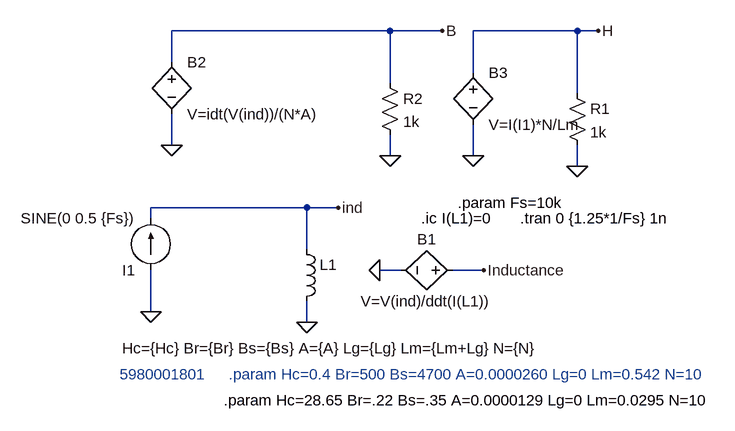
[diagram p0: schematic InductorBench2.asc]
InductorBench2.asc, the LTspice schematic file:
Version 4
SHEET 1 1124 852
WIRE 240 -192 -96 -192
WIRE 320 -192 240 -192
WIRE 528 -192 368 -192
WIRE 560 -192 528 -192
WIRE -96 -144 -96 -192
WIRE 368 -128 368 -192
WIRE 240 -112 240 -192
WIRE 528 -96 528 -192
WIRE -96 -16 -96 -64
WIRE 240 0 240 -32
WIRE 368 0 368 -48
WIRE 528 16 528 -16
WIRE 112 80 -128 80
WIRE 160 80 112 80
WIRE -128 96 -128 80
WIRE 112 144 112 80
WIRE 256 176 224 176
WIRE 384 176 336 176
WIRE -128 240 -128 176
WIRE 112 256 112 224
FLAG 112 256 0
FLAG -128 240 0
FLAG 160 80 ind
FLAG 224 176 0
FLAG 384 176 Inductance
FLAG -96 -16 0
FLAG 240 0 0
FLAG 320 -192 B
FLAG 368 0 0
FLAG 528 16 0
FLAG 560 -192 H
SYMBOL ind 96 128 R0
WINDOW 3 -268 168 Left 2
SYMATTR InstName L1
SYMATTR Value Hc={Hc} Br={Br} Bs={Bs} A={A} Lg={Lg} Lm={Lm+Lg} N={N}
SYMBOL bv 352 176 R90
WINDOW 0 -32 56 VBottom 2
WINDOW 3 32 56 VTop 2
SYMATTR InstName B1
SYMATTR Value V=V(ind)/ddt(I(L1))
SYMBOL bv -96 -160 R0
SYMATTR InstName B2
SYMATTR Value V=idt(V(ind))/(N*A)
SYMBOL res 224 -128 R0
SYMATTR InstName R2
SYMATTR Value 1k
SYMBOL current -128 176 R180
WINDOW 123 0 0 Left 0
WINDOW 39 0 0 Left 0
SYMATTR InstName I1
SYMATTR Value SINE(0 0.5 {Fs})
SYMBOL bv 368 -144 R0
SYMATTR InstName B3
SYMATTR Value V=I(I1)*N/Lm
SYMBOL res 512 -112 R0
SYMATTR InstName R1
SYMATTR Value 1k
TEXT 440 96 Left 2 !.tran 0 {1.25*1/Fs} 1n
TEXT 288 96 Left 2 !.ic I(L1)=0
TEXT -176 336 Left 2 ;5980001801
TEXT -8 336 Left 2 ;.param Hc=0.4 Br=500 Bs=4700 A=0.0000260 Lg=0 Lm=0.542 N=10
TEXT -16 376 Left 2 !.param Hc=28.65 Br=.22 Bs=.35 A=0.0000129 Lg=0 Lm=0.0295 N=10
TEXT 344 72 Left 2 !.param Fs=10k

The netlist it stands for:
* InductorBench2.asc
L1 ind 0 Hc={Hc} Br={Br} Bs={Bs} A={A} Lg={Lg} Lm={Lm+Lg} N={N}
B1 Inductance 0 V=V(ind)/ddt(I(L1))
B2 B 0 V=idt(V(ind))/(N*A)
R2 B 0 1k
I1 0 ind SINE(0 0.5 {Fs})
B3 H 0 V=I(I1)*N/Lm
R1 H 0 1k
.tran 0 {1.25*1/Fs} 1n
.ic I(L1)=0
* 5980001801
* .param Hc=0.4 Br=500 Bs=4700 A=0.0000260 Lg=0 Lm=0.542 N=10
.param Hc=28.65 Br=.22 Bs=.35 A=0.0000129 Lg=0 Lm=0.0295 N=10
.param Fs=10k
.backanno
.end